# EAGLE schematic shakeflasher (EAGLE 6.3)
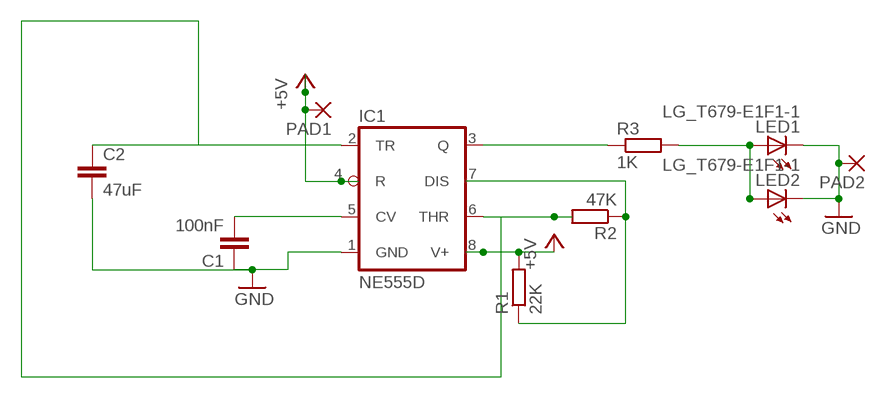
[diagram p0: schematic, sheet 1]

## Parts
C1  100nF  C-EUC0805  [C0805]
C2  47uF  C-EUC0805  [C0805]
IC1  NE555D  [SO08]
LED1  LG_T679-E1F1-1  [PLCC2]
LED2  LG_T679-E1F1-1  [PLCC2]
PAD1  SMD5  [SMD2,54-5,08]
PAD2  SMD5  [SMD2,54-5,08]
R1  22K  R-EU_R0805  [R0805]
R2  47K  R-EU_R0805  [R0805]
R3  1K  R-EU_R0805  [R0805]

## Nets
+5V: IC1.4(R) IC1.8(V+) PAD1.1(P) R1.2
GND: C1.1 C2.2 IC1.1(GND) LED1.C LED2.C PAD2.1(P)
N$1: LED1.A LED2.A R3.2
N$2: IC1.3(Q) R3.1
N$4: IC1.7(DIS) R1.1 R2.1
N$8: C2.1 IC1.2(TR) IC1.6(THR) R2.2
V: C1.2 IC1.5(CV)

## Library data of the parts
C1 C2 = resistor:C-EU: CAPACITOR, European symbol
IC1 = linear4:*555: TIMER
LED1 LED2 = led:*_T679-?-1: LC TOPLED® Low Current LED Source: http://catalog.osram-os.com .. LG_LS_LY_T679_OBS.pdf; COLOR: green
PAD1 PAD2 = wirepad:SMD5: SMD PAD
R1-R3 = resistor:R-EU_: RESISTOR, European symbol